# Altium project oxi_dev1.PrjPcb
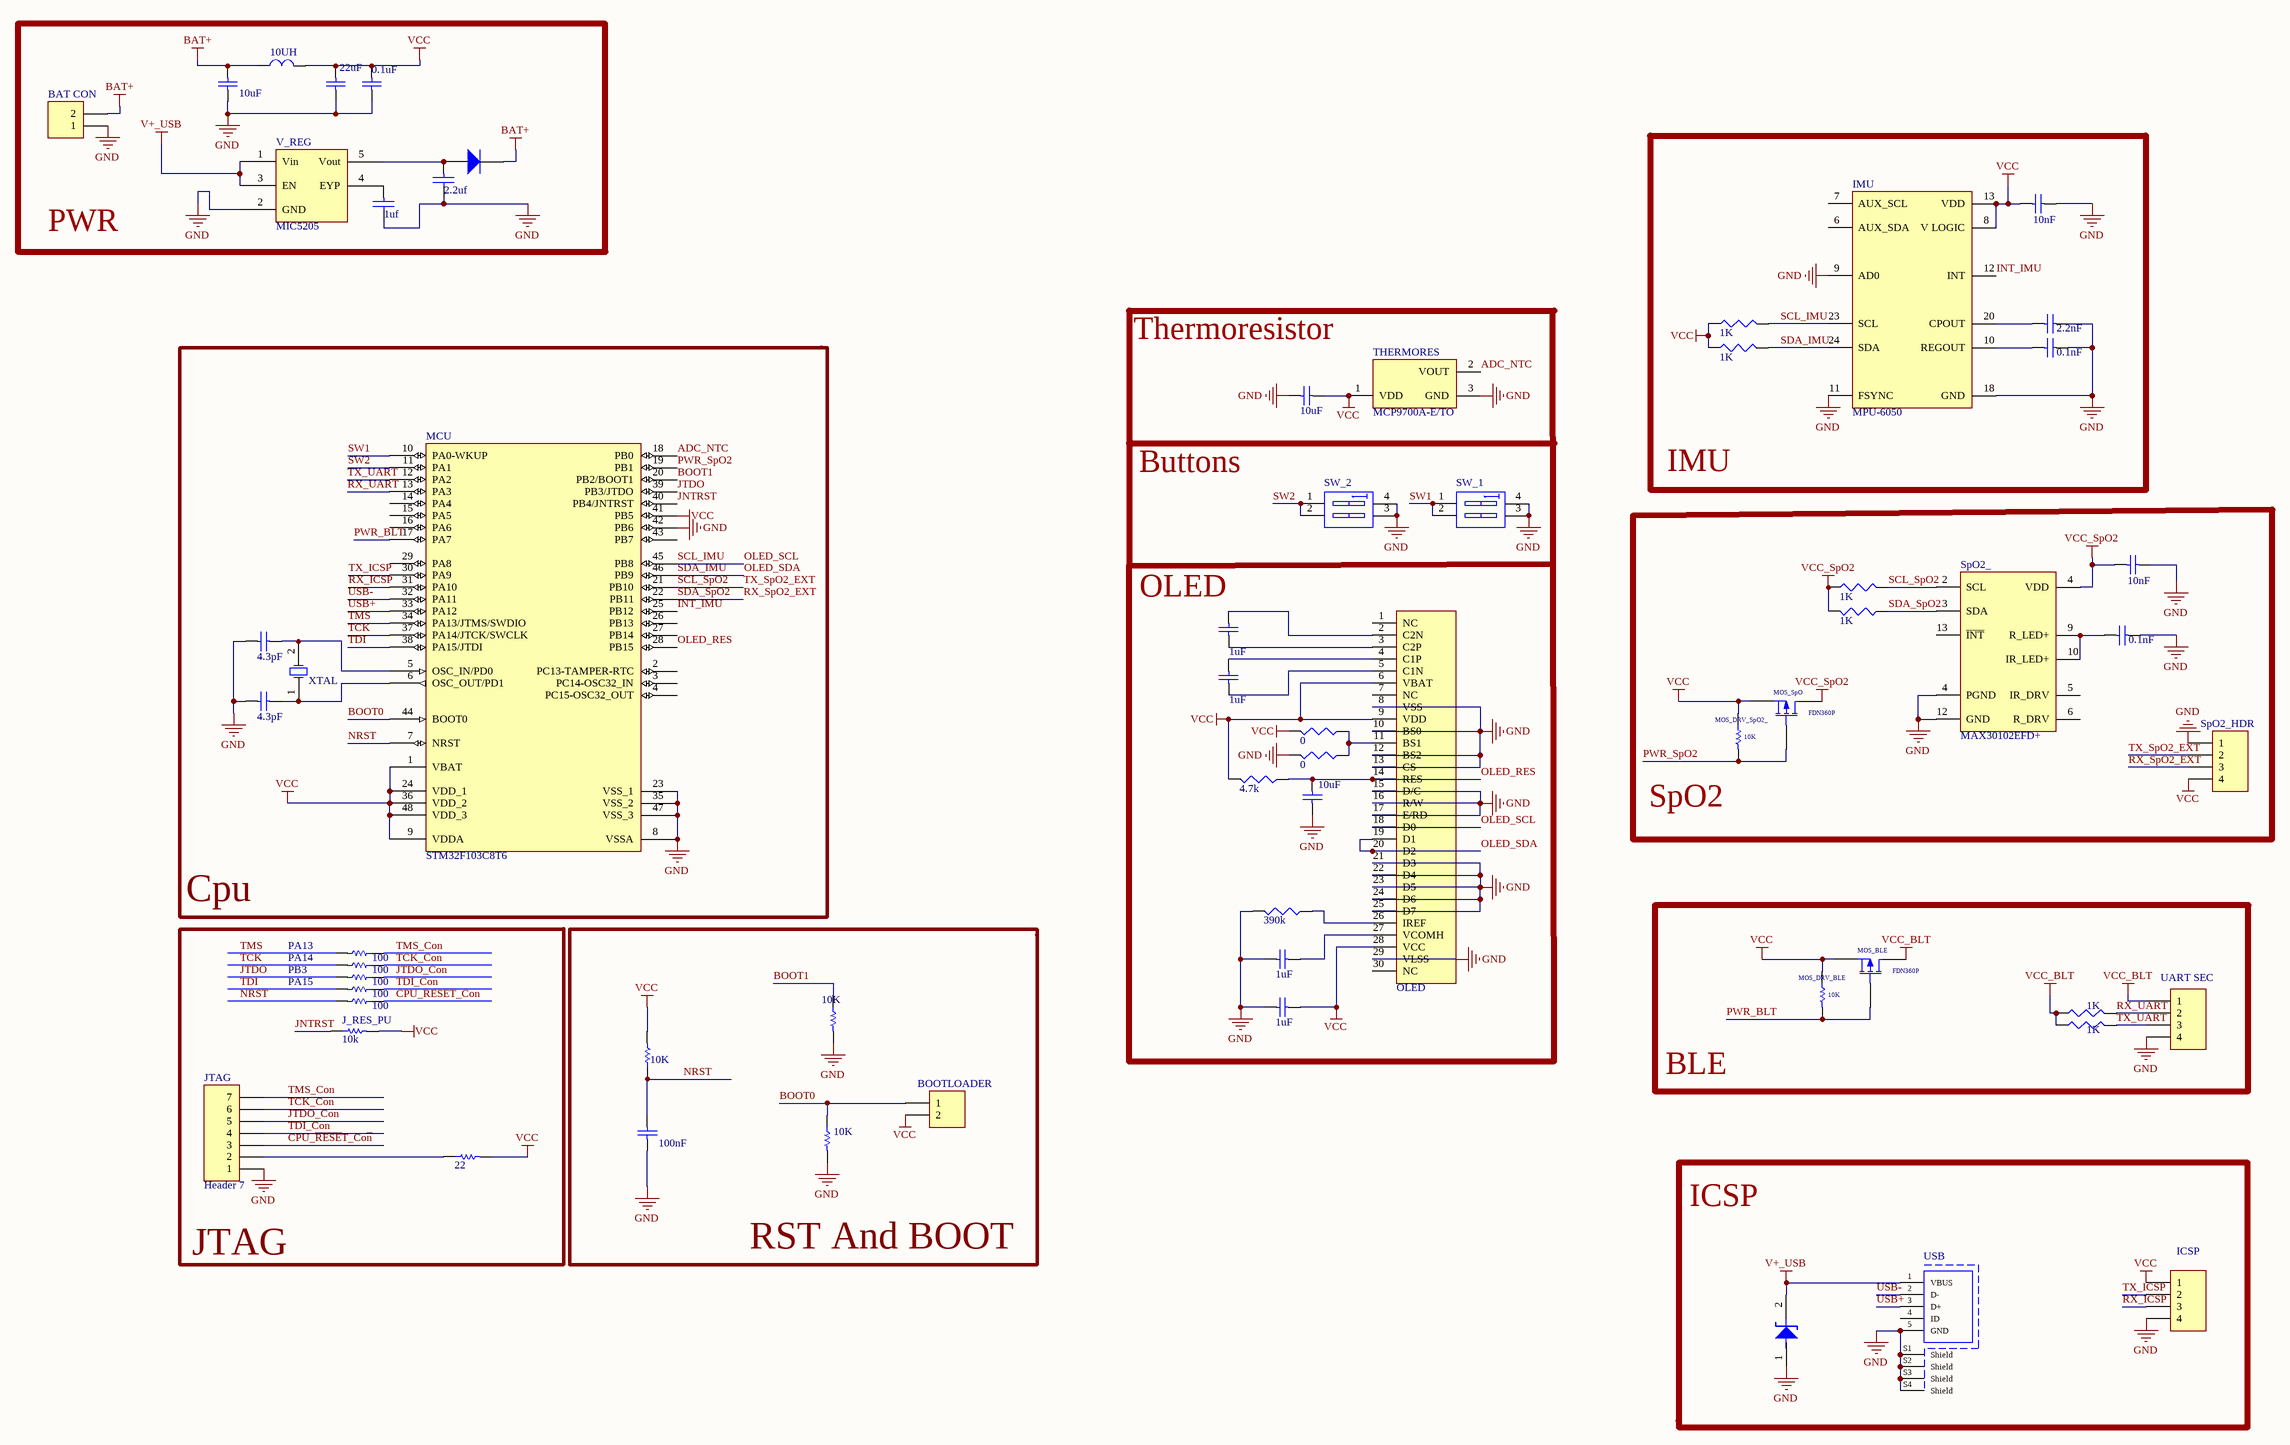
[diagram p0: oxi_dev1.SchDoc]
1 sheet, 62 parts. Net scope: global (net labels, ports and power ports of the same name join across sheets).
Board file: oxi_dev1.PcbDoc

## Sheet oxi_dev1.SchDoc
size A2

### Parts
BAT_CON  Header 2  [HDR1X2]  (value not drawn)
BOOT0_PD  10K  [SMD-0805C]
BOOT1_PD  10K  [SMD-0805C]
BOOTLOADER  Header 2  [HDR1X2]  (value not drawn)
BRIGHTNESS_RES  value 390k  [SMD-0805C]  (hidden comment: Res3)
C_1_PUMP  value 1uF  [SMD-0805C]  (hidden comment: Cap Semi)
C_2_PUMP  value 1uF  [SMD-0805C]  (hidden comment: Cap Semi)
C_PUMP_VCMON  value 1uF  [SMD-0805C]  (hidden comment: Cap Semi)
CAP_DEC_IMU  value 10nF  [SMD-0805C]  (hidden comment: Cap Semi)
CAP_LED_BYP  value 0.1nF  [SMD-0805C]  (hidden comment: Cap Semi)
CAP_LED_DEC  value 10nF  [SMD-0805C]  (hidden comment: Cap Semi)
CAP_OUT_IMU  value 0.1nF  [SMD-0805C]  (hidden comment: Cap Semi)
Cap_REG_IMU  value 2.2nF  [SMD-0805C]  (hidden comment: Cap Semi)
D_RET_CUR  Diode 1N4148  [DO-35]  (value not drawn)
ICSP  Header 4  [HDR1X4]  (value not drawn)
IMU  MPU-6050  [QFN50P400X400X95-24N]
J_RES_PU  10k  [SMD-0805C]
JTAG  Header 7  [HDR1X7]
JTDI_VDIV  100  [SMD-0805C]
JTDO_VDIV  100  [SMD-0805C]
JVCC_VDIV  22  [SMD-0805C]
L_PWR  GLFR1608T100M-LR: 10UH  [SMD-0805C]  (hidden comment: EBLS2012-101K)
MCU  STM32F103C8T6  [LQFP48_N]
MOS_BLE  FDN360P  [SOT23_N]
MOS_DRV_BLE  10K  [SMD-0805C]
MOS_DRV_SpO2_  10K  [SMD-0805C]
MOS_SpO  FDN360P  [SOT23_N]
NRST_VDIV  100  [SMD-0805C]
NTC_CAP  value 10uF  [SMD-0805C]  (hidden comment: Cap Semi)
OLED  OLED  [OLED0.96_NO3D]  (value not drawn)
OLED_C_STABILITY  value 1uF  [SMD-0805C]  (hidden comment: Cap Semi)
OLED_I2C  value 0  [SMD-0805C]  (hidden comment: Res3)
OLED_RES_PU  value 4.7k  [SMD-0805C]  (hidden comment: Res3)
OLED_SPI  value 0  [SMD-0805C]  (hidden comment: Res3)
REG_BYP  1uf  [SMD-0805C]
REG_DEC  2.2uf  [SMD-0805C]
RES_BYP  100nF  [SMD-0805C]
RES_BYPASS  value 10uF  [SMD-0805C]  (hidden comment: Cap Semi)
RES_PU  10K  [SMD-0805C]
SCL_IMU_PU  value 1K  [SMD-0805C]  (hidden comment: Res3)
SCL_SPO2_  value 1K  [SMD-0805C]  (hidden comment: Res3)
SDA_IMU_PU  value 1K  [SMD-0805C]  (hidden comment: Res3)
SDA_SPO2_  value 1K  [SMD-0805C]  (hidden comment: Res3)
SpO2_  MAX30102EFD+  [PSON80P330X560X165-14N]
SpO2_HDR  Header 4  [HDR1X4]  (value not drawn)
SW_1  SW DIP-2  [DIP-4]  (value not drawn)
SW_2  SW DIP-2  [DIP-4]  (value not drawn)
TCK_VDIV  100  [SMD-0805C]
THERMORES  MCP9700A-E/TO  [TO-92-TO3]
TMS_VDIV  100  [SMD-0805C]
UART_RX_PD  value 1K  [SMD-0805C]  (hidden comment: Res3)
UART_SEC  Header 4  [HDR1X4]  (value not drawn)
UART_TX_PD  value 1K  [SMD-0805C]  (hidden comment: Res3)
USB  Micro USB 2.0 Type B Receptacle  [629105150521]  (value not drawn)
V_REG  MIC5205  [SOT-23-OT5_N]
VOL_REG_CAP_IN  value 10uF  [SMD-0805C]  (hidden comment: Cap Semi)
VOL_REG_CAP_OUT0  value 22uF  [SMD-0805C]  (hidden comment: Cap Semi)
VOL_REG_CAP_OUT1  value 0.1uF  [SMD-0805C]  (hidden comment: Cap Semi)
XTAL  XTAL  [AXIAL-0.3]
XTAL_IN  value 4.3pF  [SMD-0805C]  (hidden comment: Cap Semi)
XTAL_OUT  value 4.3pF  [SMD-0805C]  (hidden comment: Cap Semi)
ZEN_USB  5V  [DO-35]  (value not drawn)

### Blocks framed on the sheet
PWR: BAT_CON D_RET_CUR L_PWR REG_BYP REG_DEC V_REG VOL_REG_CAP_IN VOL_REG_CAP_OUT0 VOL_REG_CAP_OUT1
IMU: CAP_DEC_IMU CAP_OUT_IMU Cap_REG_IMU IMU SCL_IMU_PU SDA_IMU_PU
Cpu: MCU XTAL XTAL_IN XTAL_OUT
SpO2: CAP_LED_BYP CAP_LED_DEC MOS_DRV_SpO2_ MOS_SpO SCL_SPO2_ SDA_SPO2_ SpO2_ SpO2_HDR
JTAG: J_RES_PU JTAG JTDI_VDIV JTDO_VDIV JVCC_VDIV NRST_VDIV TCK_VDIV TMS_VDIV
RST And BOOT: BOOT0_PD BOOT1_PD BOOTLOADER RES_BYP RES_PU
BLE: MOS_BLE MOS_DRV_BLE UART_RX_PD UART_SEC UART_TX_PD
ICSP: ICSP USB ZEN_USB

### Nets
BAT+: BAT_CON.2 D_RET_CUR.2(K) L_PWR.1 VOL_REG_CAP_IN.2
GND: BAT_CON.1 BOOT0_PD.2 BOOT1_PD.2 BRIGHTNESS_RES.2 C_PUMP_VCMON.2 CAP_DEC_IMU.2 CAP_LED_BYP.2 CAP_LED_DEC.2 CAP_OUT_IMU.2 Cap_REG_IMU.2 ICSP.4 IMU.9(AD0) IMU.11(FSYNC) IMU.18(GND) JTAG.1 MCU.8(VSSA) MCU.23(VSS_1) MCU.35(VSS_2) MCU.42(PB6) MCU.47(VSS_3) NTC_CAP.1 OLED.8(VSS) OLED.10(BS0) OLED.12(BS2) OLED.13(CS) OLED.15(D/C) OLED.16(R/W) OLED.17(E/RD) OLED.21(D3) OLED.22(D4) OLED.23(D5) OLED.24(D6) OLED.25(D7) OLED.29(VLSS) OLED_C_STABILITY.2 OLED_SPI.2 REG_BYP.2 REG_DEC.2 RES_BYP.1 RES_BYPASS.1 SpO2_.4(PGND) SpO2_.12(GND) SpO2_HDR.1 SW_1.3(B2) SW_1.4(B1) SW_2.3(B2) SW_2.4(B1) THERMORES.3(GND) UART_SEC.4 USB.5(GND) USB.S1(Shield) USB.S2(Shield) USB.S3(Shield) USB.S4(Shield) V_REG.2(GND) VOL_REG_CAP_IN.1 VOL_REG_CAP_OUT0.1 VOL_REG_CAP_OUT1.1 XTAL_IN.1 XTAL_OUT.1 ZEN_USB.1
V+_USB: USB.1(VBUS) V_REG.1(Vin) V_REG.3(EN) ZEN_USB.2
VCC: BOOTLOADER.2 CAP_DEC_IMU.1 ICSP.1 IMU.8(V_LOGIC) IMU.13(VDD) J_RES_PU.2 JVCC_VDIV.2 L_PWR.2 MCU.1(VBAT) MCU.9(VDDA) MCU.24(VDD_1) MCU.36(VDD_2) MCU.41(PB5) MCU.48(VDD_3) MOS_BLE.2(S) MOS_DRV_BLE.1 MOS_DRV_SpO2_.1 MOS_SpO.2(S) NTC_CAP.2 OLED.6(VBAT) OLED.9(VDD) OLED.28(VCC) OLED_C_STABILITY.1 OLED_I2C.2 OLED_RES_PU.2 RES_PU.2 SCL_IMU_PU.1 SDA_IMU_PU.1 SpO2_HDR.4 THERMORES.1(VDD) VOL_REG_CAP_OUT0.2 VOL_REG_CAP_OUT1.2
VCC_BLT: MOS_BLE.3(D) UART_RX_PD.1 UART_SEC.1 UART_TX_PD.1
VCC_SpO2: CAP_LED_DEC.1 MOS_SpO.3(D) SCL_SPO2_.1 SDA_SPO2_.2 SpO2_.4(VDD)
ADC_NTC: MCU.18(PB0) THERMORES.2(VOUT)
BOOT0: BOOT0_PD.1 BOOTLOADER.1 MCU.44(BOOT0)
BOOT1: BOOT1_PD.1 MCU.20(PB2/BOOT1)
CPU_~{RESE}T_Co~{n}: JTAG.3 NRST_VDIV.1
INT_IMU: IMU.12(INT) MCU.25(PB12)
JNTRST: J_RES_PU.1 MCU.40(PB4/JNTRST)
JTDO: JTDO_VDIV.2 MCU.39(PB3/JTDO)
JTDO_Con: JTAG.5 JTDO_VDIV.1
NRST: MCU.7(NRST) NRST_VDIV.2 RES_BYP.2 RES_PU.1
OLED_RES: MCU.28(PB15) OLED.14(RES) OLED_RES_PU.1 RES_BYPASS.2
OLED_SCL: IMU.23(SCL) MCU.45(PB8) OLED.18(D0) SCL_IMU_PU.2  [also labelled SCL_IMU]
OLED_SDA: IMU.24(SDA) MCU.46(PB9) OLED.19(D1) OLED.20(D2) SDA_IMU_PU.2  [also labelled SDA_IMU]
PWR_BLT: MCU.17(PA7) MOS_BLE.1(G) MOS_DRV_BLE.2
PWR_SpO2: MCU.19(PB1) MOS_DRV_SpO2_.2 MOS_SpO.1(G)
RX_ICSP: ICSP.3 MCU.31(PA10)
RX_SpO2_EXT: MCU.22(PB11) SDA_SPO2_.1 SpO2_.3(SDA) SpO2_HDR.3  [also labelled SDA_SpO2]
RX_UART: MCU.13(PA3) UART_RX_PD.2 UART_SEC.2
SCL_SpO2: MCU.21(PB10) SCL_SPO2_.2 SpO2_.2(SCL) SpO2_HDR.2  [also labelled TX_SpO2_EXT]
SW1: MCU.10(PA0-WKUP) SW_1.1(A1) SW_1.2(A2)
SW2: MCU.11(PA1) SW_2.1(A1) SW_2.2(A2)
TCK: MCU.37(PA14/JTCK/SWCLK) TCK_VDIV.2
TCK_Con: JTAG.6 TCK_VDIV.1
TDI: JTDI_VDIV.2 MCU.38(PA15/JTDI)
TDI_Con: JTAG.4 JTDI_VDIV.1
TMS: MCU.34(PA13/JTMS/SWDIO) TMS_VDIV.2
TMS_Con: JTAG.7 TMS_VDIV.1
TX_ICSP: ICSP.2 MCU.30(PA9)
TX_UART: MCU.12(PA2) UART_SEC.3 UART_TX_PD.2
USB+: MCU.33(PA12) USB.3(D+)
USB-: MCU.32(PA11) USB.2(D-)
NetBRIGHTNESS_RES_1: BRIGHTNESS_RES.1 OLED.26(IREF)
NetC_1_PUMP_1: C_1_PUMP.1 OLED.5(C1N)
NetC_1_PUMP_2: C_1_PUMP.2 OLED.4(C1P)
NetC_2_PUMP_1: C_2_PUMP.1 OLED.3(C2P)
NetC_2_PUMP_2: C_2_PUMP.2 OLED.2(C2N)
NetC_PUMP_VCMON_1: C_PUMP_VCMON.1 OLED.27(VCOMH)
NetCAP_LED_BYP_1: CAP_LED_BYP.1 SpO2_.9(R_LED+) SpO2_.10(IR_LED+)
NetCAP_OUT_IMU_1: CAP_OUT_IMU.1 IMU.10(REGOUT)
NetCap_REG_IMU_1: Cap_REG_IMU.1 IMU.20(CPOUT)
NetD_RET_CUR_1: D_RET_CUR.1(A) REG_DEC.1 V_REG.5(Vout)
NetJTAG_2: JTAG.2 JVCC_VDIV.1
NetMCU_5: MCU.5(OSC_IN/PD0) XTAL.2(OSC2) XTAL_IN.2
NetMCU_6: MCU.6(OSC_OUT/PD1) XTAL.1(OSC1) XTAL_OUT.2
NetOLED_11: OLED.11(BS1) OLED_I2C.1 OLED_SPI.1
NetREG_BYP_1: REG_BYP.1 V_REG.4(EYP)

Not connected (* = marked no-connect by the designer): IMU 6(AUX_SDA) 7(AUX_SCL); MCU 2(PC13-TAMPER-RTC) 3(PC14-OSC32_IN) 4(PC15-OSC32_OUT) 14(PA4) 15(PA5) 16(PA6) 26(PB13) 27(PB14) 29(PA8) 43(PB7); OLED 1(NC) 7(NC) 30(NC); SpO2_ 5(IR_DRV) 6(R_DRV) 13(~{INT}); USB 4(ID)

### Notes on the sheet
- (near THERMORES) Thermoresistor
- Buttons
- (near C_2_PUMP) OLED
- PB3
- PA15
- PA14
- PA13

### Library data of the parts
BAT_CON BOOTLOADER = Header 2: Header, 2-Pin; LatestRevisionDate: 17-Jul-2002; LatestRevisionNote: Re-released for DXP Platform.; Publisher: Altium Limited
BOOT0_PD BOOT1_PD J_RES_PU JTDI_VDIV JTDO_VDIV JVCC_VDIV NRST_VDIV TCK_VDIV TMS_VDIV = Res1: Resistor; Value: 1K; Published: 8-Jun-2000; Revision: July-2002: Re-released for DXP Platform.; Publisher: Altium Limited
BRIGHTNESS_RES OLED_I2C OLED_RES_PU OLED_SPI SCL_IMU_PU SCL_SPO2_ SDA_IMU_PU SDA_SPO2_ UART_RX_PD UART_TX_PD = Res3: Resistor; Published: 8-Jun-2000; LatestRevisionDate: 29-May-2009; LatestRevisionNote: IPC-7351 Footprint Added.; PackageReference: J1-0603; Publisher: Altium Limited; PackageDescription: Chip Resistor
C_1_PUMP C_2_PUMP C_PUMP_VCMON CAP_DEC_IMU CAP_LED_BYP CAP_LED_DEC CAP_OUT_IMU Cap_REG_IMU NTC_CAP OLED_C_STABILITY RES_BYPASS VOL_REG_CAP_IN VOL_REG_CAP_OUT0 VOL_REG_CAP_OUT1 XTAL_IN XTAL_OUT = Cap Semi: Capacitor (Semiconductor SIM Model); Published: 8-Jun-2000; LatestRevisionDate: 29-May-2009; LatestRevisionNote: IPC-7351 Footprint Added.; PackageReference: C1206; Publisher: Altium Limited; PackageDescription: Chip Capacitor
D_RET_CUR = Diode 1N4148: High Conductance Fast Diode; Published: 8-Jun-2000; LatestRevisionDate: 17-Jul-2002; LatestRevisionNote: Re-released for DXP Platform.; DatasheetVersion: 1997; PackageReference: DO-35; Publisher: Altium Limited; PackageDescription: Diode, Axial; Body 3.8 x 1.9 mm (LxDia. max), Lead Dia. 0.53 mm (max); Code_JEDEC: DO-204-AH; ComponentLink1Description: Manufacturer Link; ComponentLink1URL: http://www.fairchildsemi.com/; ComponentLink2Description: Datasheet; ComponentLink2URL: http://www.fairchildsemi.com/ds/1N%2F1N4148.pdf
ICSP SpO2_HDR UART_SEC = Header 4: Header, 4-Pin; LatestRevisionDate: 17-Jul-2002; LatestRevisionNote: Re-released for DXP Platform.; Publisher: Altium Limited
IMU = MPU-6050: Accelerometer, Gyroscope, 6 Axis Sensor IÂ²C Output; MF: TDK InvenSense; Price: None; Package: VFQFN-24 TDK InvenSense; MP: MPU-6050; Value: *; Availability: Unavailable; SnapEDA_Link: https://www.snapeda.com/parts/MPU-6050/TDK%20InvenSense/view-part/4503180/?ref=snap
JTAG = Header 7: Header, 7-Pin; LatestRevisionDate: 17-Jul-2002; LatestRevisionNote: Re-released for DXP Platform.; Publisher: Altium Limited
L_PWR = INDUCTOR: Inductor 100UH (0805)
MCU = STM32F103C8T6: STM32 ARM-based 32-bit MCU with 64 Kbytes Flash, 48-pin LQFP, Industrial Temperature; Published: 30-May-2008; DatasheetVersion: rev6, Mar-2008; PackageVersion: Mar-2008; PackageReference: LQFP48; Publisher: Altium Limited; PackageDescription: 48-Pin Low-Profile Quad Flat Pack, 7 x 7 mm Body, 0.5 mm Pitch (LQFP48); ComponentLink1Description: Manufacturer Link; ComponentLink1URL: www.st.com/stm32; ComponentLink2Description: Datasheet; ComponentLink2URL: http://www.st.com/stonline/products/literature/ds/13587.pdf
MOS_BLE MOS_SpO = MOSFET-P: P-Channel MOSFET; Published: 8-Jun-2000; LatestRevisionDate: 17-Jul-2002; LatestRevisionNote: Re-released for DXP Platform.; PackageVersion: 1995/1996; PackageReference: E3; Publisher: Altium Limited; PackageDescription: TO, Flat Index; 3 In-Line, Axial Leads; Body Dia. 4.6mm; Lead Dia. 0.5 mm (max)
MOS_DRV_BLE MOS_DRV_SpO2_ RES_PU = res1: Resistor; Value: 1K; Published: 8-Jun-2000; Revision: July-2002: Re-released for DXP Platform.; Publisher: Altium Limited
OLED = OLED0.96
REG_BYP REG_DEC = CAP: Capacitor
RES_BYP = CAP: Capacitor; Value: 100pF; Published: 8-Jun-2000; Revision: July-2002: Re-released for DXP Platform.; Publisher: Altium Limited
SpO2_ = MAX30102EFD+: Oximeter/Heart Rate Sensor IÂ²C Output; MF: Maxim Integrated; Price: None; Value: *; Package: OLGA-14 Maxim; Availability: Unavailable; SnapEDA_Link: https://www.snapeda.com/parts/MAX30102EFD%2B/Maxim%20Integrated/view-part/397548/?ref=snap; MP: MAX30102EFD+
SW_1 SW_2 = SW DIP-2: DIP Switch, 2 Position, SPST; Published: 24-Mar-1999; LatestRevisionDate: 17-Jul-2002; LatestRevisionNote: Re-released for DXP Platform.; PackageReference: DIP-4; Publisher: Altium Limited
THERMORES = MCP9700A-E/TO: Low-Power Linear Active Thermistor IC, 3-Pin TO-92, Extended Temperature; Published: 29-Jan-2009; LatestRevisionDate: 02-Dec-2009; LatestRevisionNote: Updated datasheet to version revE, Apr-2009.; DatasheetVersion: revE, Apr-2009; PackageVersion: revBB, Aug-2009; PackageReference: TO-92-TO3; Publisher: Altium Limited; PackageDescription: 3-Lead Plastic Transistor Outline (TO) [TO-92]; Supplier 1: Digi-Key; Supplier Part Number 1: MCP9700A-E/TO-ND; Supplier 2: Farnell; Supplier Part Number 2: 1332164; ComponentLink1Description: Datasheet; ComponentLink1URL: http://ww1.microchip.com/downloads/en/DeviceDoc/21942e.pdf; ComponentLink2Description: Packaging Specification; ComponentLink2URL: http://www.microchip.com/stellent/groups/techpub_sg/documents/packagingspec/en012702.pdf; ComponentLink3Description: Microchip.com Home; ComponentLink3URL: http://www.microchip.com/
USB = 629105150521: Micro USB 2.0 Type B, Receptacle, Horizontal, SMT, with Pegs; Rated Current: 3A; Pin Number: 5; Interface Type: Type B; Working Voltage: 30VAC; ComponentLink1Description: Manufacturer; ComponentLink1URL: http://www.we-online.de; ComponentLink2Description: Datasheet; ComponentLink2URL: https://katalog.we-online.com/em/datasheet/629105150521.pdf; Published Date: September 2019; Publisher: Wurth Elektronik; Part Number: 629105150521; Gender: Receptacle; Type: Horizontal; Packaging: Tape and Reel; Operating Temperature: -40 to +85degC; Mounting Technology: SMT; Application: Micro USB 2.0
V_REG = MIC5205: 150mA Low-Noise LDO Regulator
XTAL = XTAL: Crystal Oscillator; Published: 8-Jun-2000; LatestRevisionDate: 17-Jul-2002; LatestRevisionNote: Re-released for DXP Platform.; PackageReference: R38; Publisher: Altium Limited; PackageDescription: Crystal, Thru-Hole; 2 Leads; Body 3.1 x 8.2 mm (Dia.xH)
ZEN_USB = ZENER